# Altium schematic sheet POWER.SchDoc (part 1 of 3)
size A3; DocumentNumber: 4; SheetNumber: 4; SheetTotal: 5
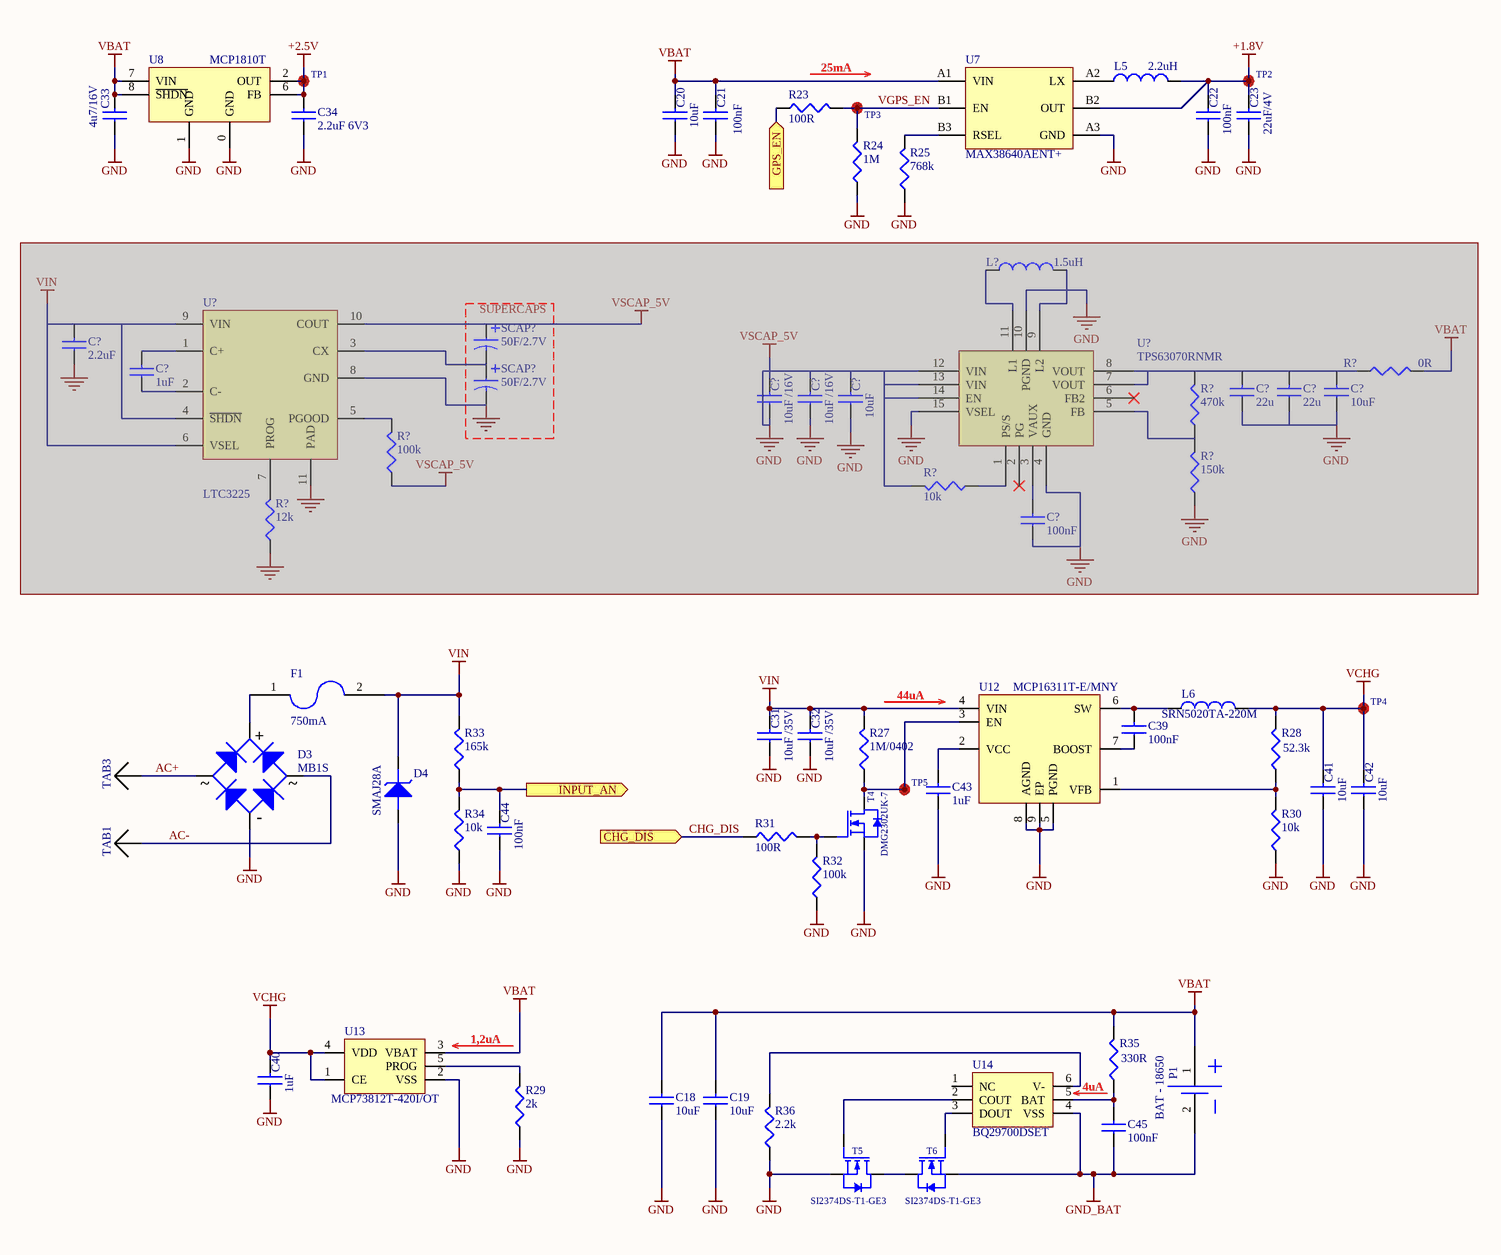
[diagram p0: POWER.SchDoc]

## Parts
(Parts that share a designator on the sheet are numbered #1, #2 ... from top to bottom, then left to right.)
C18  10uF  [CAP0603]
C19  10uF  [CAP0603]
C20  10uF  [CAP0603]
C21  100nF  [CAP0402]
C22  100nF  [CAP0402]
C23  22uF/4V  [CAP0603]
C31  10uF /35V  [CAP0805]
C32  10uF /35V  [CAP0805]
C33  4u7/16V  [CAP0603]
C34  2.2uF 6V3  [CAP0402]
C39  100nF  [CAP0402]
C40  1uF  [CAP0402]
C41  10uF  [CAP0603]
C42  10uF  [CAP0603]
C43  1uF  [CAP0402]
C44  100nF  [CAP0402]
C45  100nF  [CAP0402]
C?#1  2.2uF  [CAP0805]  (masked out: inside a compile mask, not in the netlist)
C?#2  1uF  [CAP0603]  (masked out: inside a compile mask, not in the netlist)
C?#3  10uF /16V  [CAP0805]  (masked out: inside a compile mask, not in the netlist)
C?#4  10uF /16V  [CAP0805]  (masked out: inside a compile mask, not in the netlist)
C?#5  22u  [CAP0805]  (masked out: inside a compile mask, not in the netlist)
C?#6  22u  [CAP0805]  (masked out: inside a compile mask, not in the netlist)
C?#7  10uF  [CAP0603]  (masked out: inside a compile mask, not in the netlist)
C?#8  10uF  [CAP0603]  (masked out: inside a compile mask, not in the netlist)
C?#9  100nF  [CAP0603]  (masked out: inside a compile mask, not in the netlist)
D3  MB1S  [MB1S]
D4  SMAJ28A  [DO-214AC (SMA)]
F1  750mA  [FUSE0603]
L5  2.2uH  [IND2.3X1.7]
L6  SRN5020TA-220M  [SRN5020TA]
L?  1.5uH  [FDSD0402]  (masked out: inside a compile mask, not in the netlist)
P1  BAT - 18650  [BATTERY 18650 - SMD TAB]
R23  100R  [RES0402]
R24  1M  [RES0402]
R25  768k  [RES0402]
R27  1M/0402  [RES0402]
R28  52.3k  [RES0402]
R29  2k  [RES0402]
R30  10k  [RES0402]
R31  100R  [RES0402]
R32  100k  [RES0402]
R33  165k  [RES0402]
R34  10k  [RES0402]
R35  330R  [RES0402]
R36  2.2k  [RES0402]
R?#1  0R  [RES0603]  (masked out: inside a compile mask, not in the netlist)
R?#2  470k  [RES0603]  (masked out: inside a compile mask, not in the netlist)
R?#3  100k  [RES0603]  (masked out: inside a compile mask, not in the netlist)
R?#4  150k  [RES0603]  (masked out: inside a compile mask, not in the netlist)
R?#5  10k  [RES0603]  (masked out: inside a compile mask, not in the netlist)
R?#6  12k  [RES0603]  (masked out: inside a compile mask, not in the netlist)
SCAP?#1  50F/2.7V  [Super Capacitor Horizontal]  (masked out: inside a compile mask, not in the netlist)
SCAP?#2  50F/2.7V  [Super Capacitor Horizontal]  (masked out: inside a compile mask, not in the netlist)
T4  DMG2302UK-7  [SOT23-3AL]
T5  SI2374DS-T1-GE3  [SOT23-3AL]
T6  SI2374DS-T1-GE3  [SOT23-3AL]
TAB1  WP-SMBU SMD  [WP-SMBU]  (value not drawn)
TAB3  WP-SMBU SMD  [WP-SMBU]  (value not drawn)
TP1  TestPoint  [TestPoint:1.2x1.2mm]  (value not drawn)
TP2  TestPoint  [TestPoint:1.2x1.2mm]  (value not drawn)
TP3  TestPoint  [TestPoint:1.2x1.2mm]  (value not drawn)
TP4  TestPoint  [TestPoint:1.2x1.2mm]  (value not drawn)
TP5  TestPoint  [TestPoint:1.2x1.2mm]  (value not drawn)
U7  MAX38640AENT+  [WLP-6]
U8  MCP1810T  [VDFN_2x2]
U12  MCP16311T-E/MNY  [TDFN-8]
U13  MCP73812T-420I/OT  [SOT23-5]
U14  BQ29700DSET  [PWSON-6]
U?#1  LTC3225  [PSON50P200X80_HS-11N]  (masked out: inside a compile mask, not in the netlist)
U?#2  TPS63070RNMR  [VQFN TPS]  (masked out: inside a compile mask, not in the netlist)

## Blocks framed on the sheet
SUPERCAPS: SCAP?#1 SCAP?#2

## Ports
CHG_DIS (in), GPS_EN (in), INPUT_AN (out)

## Nets
+1.8V: C22.2 C23.2 L5.2 TP2.0 U7.B2(OUT)
+2.5V: C34.2 TP1.0 U8.2(OUT) U8.6(FB)
GND: C18.1 C19.1 C20.1 C21.1 C22.1 C23.1 C31.1 C32.1 C33.1 C34.1 C40.1 C41.1 C42.1 C43.1 C44.1 D3.2(cathode) D4.A(ANODE) R24.1 R25.1 R29.1 R30.1 R32.1 R34.1 R36.1 T4.2(S) T5.2(S) U7.A3(GND) U8.0(GND) U8.1(GND) U12.5(PGND) U12.8(AGND) U12.9(EP) U13.2(VSS)
GND_BAT: C45.1 P1.2 T6.2(S) U14.4(VSS)
VBAT: C18.2 C19.2 C20.2 C21.2 C33.2 P1.1 R35.2 U7.A1(VIN) U8.7(VIN) U8.8(~{SHDN}) U13.3(VBAT)
VCHG: C40.2 C41.2 C42.2 L6.2 R28.2 TP4.0 U13.1(CE) U13.4(VDD)
VIN: C31.2 C32.2 D4.K(cathode) F1.2 R27.2 R33.2 U12.4(VIN)
AC+: D3.4(cathode) TAB3.1(ALERT)
AC-: D3.3(cathode) TAB1.1(ALERT)
CHG_DIS: R31.1 ; port CHG_DIS
GPS_EN: R23.1 ; port GPS_EN
INPUT_AN: C44.2 R33.1 R34.2 ; port INPUT_AN
VGPS_EN: R23.2 R24.2 TP3.0 U7.B1(EN)
NetC39_1: C39.1 U12.7(BOOST)
NetC39_2: C39.2 L6.1 U12.6(SW)
NetC43_2: C43.2 U12.2(VCC)
NetC45_2: C45.2 R35.1 U14.5(BAT)
NetD3_1: D3.1(cathode) F1.1
NetL5_1: L5.1 U7.A2(LX)
NetR25_2: R25.2 U7.B3(RSEL)
NetR27_1: R27.1 T4.3(D) TP5.0 U12.3(EN)
NetR28_1: R28.1 R30.2 U12.1(VFB)
NetR29_2: R29.2 U13.5(PROG)
NetR31_2: R31.2 R32.2 T4.1(G)
NetR36_2: R36.2 U14.6(V-)
NetT5_1: T5.1(G) U14.2(COUT)
NetT5_3: T5.3(D) T6.3(D)
NetT6_1: T6.1(G) U14.3(DOUT)

Not connected (* = marked no-connect by the designer): U14 1(NC)

## Notes on the sheet
- 25mA
- 44uA
- 1,2uA
- (near R35) 4uA
- Size: A3
- Revision:
- Sheet
- of
- (in symbol D_GREZ - MB1S) +; ~